# Altium schematic sheet MDB.SchDoc: MDB
size A4; Date: 19 08 2019; Author: Rachid AKKOUCHE; DrawnBy: Rachid AKKOUCHE; Engineer: Rachid AKKOUCHE; DocumentNumber: BRA201909261; Revision: II B; SheetNumber: 3; SheetTotal: 3; Telephone: +33651604047; Email: rachid.akkouche@wanadoo.fr; Proprietaire: Rachid AKKOUCHE; Dessinepar: -; Verifiepar: -; Property: Rachid AKKOUCHE; Time: 08:00
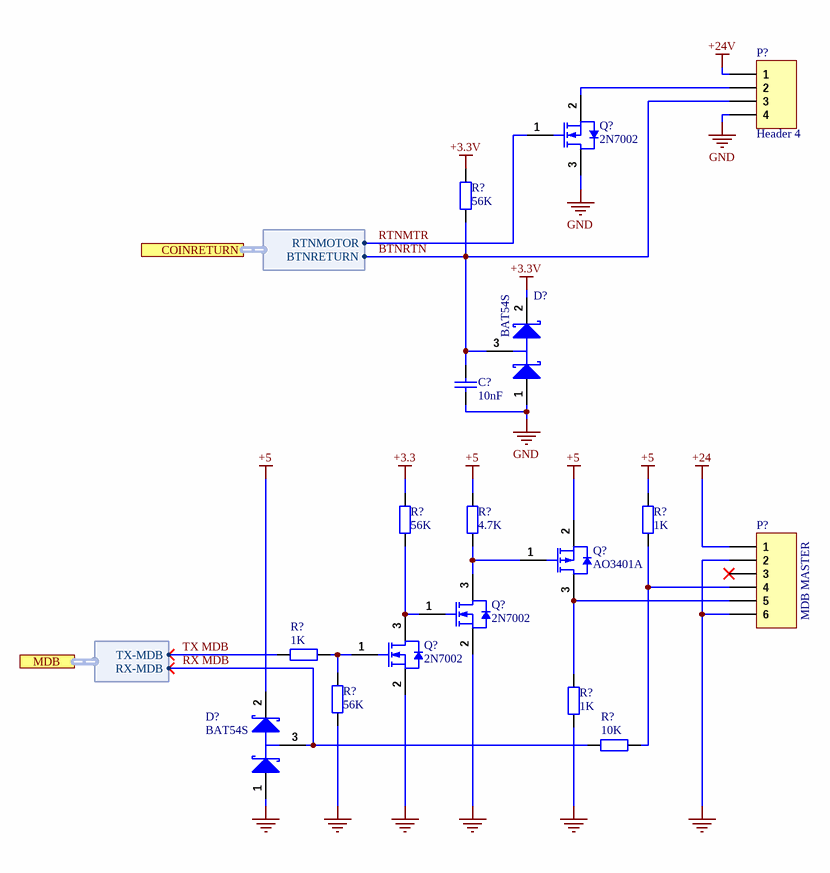
[diagram p0: MDB.SchDoc]

## Parts
(Parts that share a designator on the sheet are numbered #1, #2 ... from top to bottom, then left to right.)
C?  10nF  [C0805]
D?#1  BAT54S  [SOT23]
D?#2  BAT54S  [SOT23]
P?#1  Header 4  [Molex 22112042]
P?#2  MDB MASTER  [MOLEX 39-28-1063]
Q?#1  2N7002  [SOT23]
Q?#2  AO3401A  [SOT23]
Q?#3  2N7002  [SOT23]
Q?#4  2N7002  [SOT23]
R?#1  56K  [R0805]
R?#2  4.7K  [R 0805(2012)]
R?#3  1K  [R 0805(2012)]
R?#4  56K  [R 0805(2012)]
R?#5  1K  [R 0805(2012)]
R?#6  56K  [R 0805(2012)]
R?#7  1K  [R 0805(2012)]
R?#8  10K  [R 0805(2012)]

## Ports
COINRETURN (harness Return), MDB (harness MDB)

## Harnesses
MDB: RX-MDB, TX-MDB
Return: RTNMOTOR, BTNRETURN

## Nets
+3.3: R?#4.1
+3.3V: D?#1.2(K) R?#1.1
+5: D?#2.2(K) Q?#2.2(S) R?#2.2 R?#3.2
+24: P?#2.1
+24V: P?#1.1
GND: C?.2 D?#1.1(A) D?#2.1(A) P?#1.4 P?#2.2 P?#2.6 Q?#1.3(D) Q?#3.2(S) Q?#4.2(S) R?#6.1 R?#7.1
BTNRTN: C?.1 D?#1.3(C) P?#1.3 R?#1.2 ; port COINRETURN.BTNRETURN
RTNMTR: Q?#1.1(G) ; port COINRETURN.RTNMOTOR
RX MDB: D?#2.3(C) R?#8.2 ; port MDB.RX-MDB
TX MDB: R?#5.2 ; port MDB.TX-MDB
NetP?#1_2: P?#1.2 Q?#1.2(S)
NetP?#2_4: P?#2.4 R?#3.1 R?#8.1
NetP?#2_5: P?#2.5 Q?#2.3(D) R?#7.2
NetQ?#2_1: Q?#2.1(G) Q?#3.3(D) R?#2.1
NetQ?#3_1: Q?#3.1(G) Q?#4.3(D) R?#4.2
NetQ?#4_1: Q?#4.1(G) R?#5.1 R?#6.2

Not connected (* = marked no-connect by the designer): P?#2 3*

## Notes on the sheet
- Ce document est la propriété de
- Project:
- Il ne peut être divulgué sans l'accord écrit de l'un de ses représentants dûment mandaté
- Title:
- Number:
- Date:
- Time:
- Size:
- A4
- Revision:
- Sheet
- of
- 2, rue Georges MELIES
- Draw by:
- 78390 BOIS D'ARCY

## Library data of the parts
C? = Cap 0805 100nF: Capacitor; Manufacturer: MULTICOMP; Manufacturer Part Number: MC0805F103Z500CT; Gamme de produit: Série MC; Capacité: 0.01; Tolérance de capacité: +80%, -20%; Diélectrique: Y5; Tension: 50; Boîtier de condensateur Céramique: 0805 [2012 Metric]; Température d'utilisation min: -30; Température de fonctionnement max..: 85; Type de packaging: Bande découpée; SVHC: No SVHC (15-Jun-2015); Bornes de condensateur: CMS; Température de fonctionnement: -30°C à +85; Tolérance de capacité ±: +80%, -20; Supplier 1: Farnell; Supplier Part Number 1: 1759247; RoHS: YES; Stock 1: 94719; Pricing 1: 10=0.0277, 250=0.025, 500=0.0222, 1000=0.0148, 2000=0.0111, 4000=0.0089, 20000=0.0059, 40000=0.0047 (EUR); MSL: -; ComponentLink1URL: http://www.farnell.com/datasheets/1901289.pdf; ComponentLink1Description: http://www.farnell.com/datasheets/1901289.pdf
D?#1 = BAT54S: Schottky Barrier Double Diode; Manufacturer: MULTICOMP; Courant, If moy.: 200; Tension, Vrrm: 30; Tension, Vf max..: 400; Temps trr max.: 5; Courant, Ifs max.: 600; Type de boîtier diode: SOT-23; Nombre de broches: 3; SVHC: No SVHC (19-Dec-2012); Configuration diode: Dual Series; Température, Tj max..: 150; Type de terminaison: SMD; Température d'utilisation min: -55; Courant, If, Vf: 10; Courant, Ir, max..: 2; Marquage, CMS: L44; Température de fonctionnement: -55°C à +150; Type de packaging: Bande découpée; Tension, direct à  If: 800; Supplier 1: Farnell; Supplier Part Number 1: 1621835; Manufacturer Part Number: BAT54S; RoHS: YES; Stock 1: 52055; Pricing 1: 10=0,102, 250=0,074, 1000=0,06, 3000=0,053 (EUR); Diode Type: Schottky; Type de boîtier: SOT-23; courant Ifsm: 600; ComponentLink1URL: http://www.farnell.com/datasheets/1317753.pdf; ComponentLink1Description: http://www.farnell.com/datasheets/1317753.pdf; Température de fonctionnement max..: 150; Supplier 2: Farnell; Supplier Part Number 2: 1467519; Stock 2: 11232; Pricing 2: 5=0,157, 90=0,066, 250=0,056, 750=0,0443, 1500=0,0388 (EUR); Type de boîtier de diode: SOT-23; MSL: MSL 1 - Illimité; Type de diode: Schottky; ComponentLink2URL: http://www.farnell.com/datasheets/1997854.pdf; ComponentLink2Description: http://www.farnell.com/datasheets/1997854.pdf
D?#2 = BAT54S: Schottky Barrier Double Diode; Manufacturer: MULTICOMP; Courant, If moy.: 200; Tension, Vrrm: 30; Tension, Vf max..: 400; Temps trr max.: 5; Courant, Ifs max.: 600; Type de boîtier diode: SOT-23; Nombre de broches: 3; SVHC: No SVHC (19-Dec-2012); Configuration diode: Dual Series; Température, Tj max..: 150; Type de terminaison: SMD; Température d'utilisation min: -55; Courant, If, Vf: 10; Courant, Ir, max..: 2; Marquage, CMS: L44; Température de fonctionnement: -55°C à +150; Supplier 1: Farnell; Supplier Part Number 1: 1621835; Manufacturer Part Number: BAT54S; RoHS: YES; Stock 1: 52055; Pricing 1: 10=0,102, 250=0,074, 1000=0,06, 3000=0,053 (EUR); Diode Type: Schottky; Type de boîtier: SOT-23; courant Ifsm: 600; ComponentLink1URL: http://www.farnell.com/datasheets/1317753.pdf; ComponentLink1Description: http://www.farnell.com/datasheets/1317753.pdf; Température de fonctionnement max..: 150
P?#1 = Header 4: Header, 4-Pin; Manufacturer: TE CONNECTIVITY / AMP; Manufacturer Part Number: 640454-4; Gamme de produit: Série MTA-100; Type de terminaison de contact: Traversant; Genre: Embase; Nombre de contacts: 4; Pas: 2.54; Plaquage du contact: Contacts plaqués étain; Matériau du contact: Alliage de cuivre; Nombre de rangées: 1; Méthode de terminaison: A souder; Tension nominale Vac: 250; Terminaison du contact: Traversant vertical<!--FANDB--><div class="features-and-benefits-container"><div class="features-and-benefits-description"><span class="features-benefits-value">The 640454-4 is a 4-position 1-row unshrouded Polarized Header with pin type tin-plated copper alloy straight posts, UL94V-0-rated glass-filled polyester housing and nickel-plated underplate. This vertical header is suitable for use with MTA-100 connector assembly.</span></div><div class="features-and-benefits-list"><ul class="features-and-benefits-list-list"><li class="features-and-benefits-list-item">250VAC Operating voltage</li><li class="features-and-benefits-list-item">5A Contact current rating</li><li class="features-and-benefits-list-item">UL94V-0 Flammability rating</li></ul></div><div class="features-and-benefits-applications"><ul class="features-and-benefits-value"><li class="features-and-benefits-list-item">Industrie</li></ul></div></div>; A utiliser avec: MTA .100 Headers & MTA .100 IDC Posted Connectors; Supplier 1: Farnell; Supplier Part Number 1: 588490; RoHS: YES; Stock 1: 22887; Pricing 1: 5=0.173, 50=0.0985, 500=0.0828, 1000=0.0599 (EUR); Courant: 4; Tension, fonctionnement: 250; ComponentLink1URL: http://www.farnell.com/datasheets/1667877.pdf; ComponentLink1Description: http://www.farnell.com/datasheets/1667877.pdf; ComponentLink2URL: http://www.farnell.com/cad/1650873.pdf; ComponentLink2Description: http://www.farnell.com/cad/1650873.pdf; ComponentLink3URL: http://www.farnell.com/datasheets/2007156.pdf; ComponentLink3Description: http://www.farnell.com/datasheets/2007156.pdf; Supplier 2: Farnell; Supplier Part Number 2: 2468503; Stock 2: 2449; Pricing 2: 10=0.31, 100=0.279, 500=0.251, 1000=0.226, 5000=0.203, 10000=0.183 (EUR); Nombre de Positions: 4; ComponentLink4URL: http://www.farnell.com/cad/1651660.pdf; ComponentLink4Description: http://www.farnell.com/cad/1651660.pdf
P?#2 = MOLEX 039281063: 6 Pin Vertical Header MINI FIT JR MOLEX PN 39281063 WITHOUT PEGS * Disc by Waytek; Max Voltage Rating (DC): 600.6kV; Current Rating: 9A; Voltage Rating: 600V; Max Current Rating: 3A; Number of Poles: 6; Voltage Rating (AC): 250V; Connector Type: Power,Rectangular; Gender: Male; Insulation Resistance: 1GR; Pitch: 4.2mm; Approvals: UL,CSA,TUV; Glow Wire Compliant: Non-compliant; Supplier 1: Farnell; Manufacturer 1: Molex; Manufacturer Part Number 1: 39-28-1063; RoHS: Yes; Category: Headers and Wire Housings; Stock 1: 11240; Mount: Through Hole; Contact Plating: Tin,Gold; Contact Material: Brass,Bronze; Color: Natural,Clear; Material: Nylon; Housing Color: Black; Housing Material: Nylon; Min Operating Temperature: -40°C; Max Operating Temperature: 105°C; Number of Rows: 2; Contact Gender: Male; Packaging: Bulk; Number of Positions: 6; Termination: Solder; Number of Contacts: 6; Working Voltage: 250V; Orientation: Straight; Voltage Rating (DC): 600V; Number of Circuits: 6; Length: 101.19mm; Height: 6.04mm; Lead Pitch: 4.2mm; Row Spacing: 4.2mm; Depth: 14.18mm; Radiation Hardening: No; REACH SVHC: Unknown; Halogen Free: Low Halogen; Lead Free: Lead Free; Flammability Rating: UL94 V-2; ComponentLink1URL: https://datasheet.ciiva.com/19462/1968769-19462120.pdf?src-supplier=Jameco; ComponentLink1Description: https://datasheet.ciiva.com/19462/1968769-19462120.pdf?src-supplier=Jameco; ComponentLink2URL: https://datasheet.ciiva.com/11748/0900766b80460da2-11748025.pdf?src-supplier=RSComponents; ComponentLink2Description: https://datasheet.ciiva.com/11748/0900766b80460da2-11748025.pdf?src-supplier=RSComponents; ComponentLink3URL: https://datasheet.ciiva.com/25908/0039281063-pcb-headers-25908512.pdf?src-supplier=Avnet+Europe; ComponentLink3Description: https://datasheet.ciiva.com/25908/0039281063-pcb-headers-25908512.pdf?src-supplier=Avnet+Europe; ComponentLink4URL: https://datasheet.ciiva.com/5152/0039281063-pcb-headers-228415-5152246.pdf?src-supplier=Mouser; ComponentLink4Description: https://datasheet.ciiva.com/5152/0039281063-pcb-headers-228415-5152246.pdf?src-supplier=Mouser; ComponentLink5URL: https://datasheet.ciiva.com/26916/getdatasheetpartid-292509-26916569.pdf?src-supplier=Verical; ComponentLink5Description: https://datasheet.ciiva.com/26916/getdatasheetpartid-292509-26916569.pdf?src-supplier=Verical; ComponentLink6URL: https://datasheet.ciiva.com/16468/0039281063-pcb-headers-16468972.pdf?src-supplier=Avnet+Asia; ComponentLink6Description: https://datasheet.ciiva.com/16468/0039281063-pcb-headers-16468972.pdf?src-supplier=Avnet+Asia; ComponentLink7URL: https://datasheet.ciiva.com/20209/22-3810e-20209534.pdf?src-supplier=Rapid+Electronics; ComponentLink7Description: https://datasheet.ciiva.com/20209/22-3810e-20209534.pdf?src-supplier=Rapid+Electronics; Supplier Part Number 1: 9732101
Q?#1 = 2N7002: N-channel Enhancement Mode Field-effect Transistor; Manufacturer: FAIRCHILD SEMICONDUCTOR; Supplier 1: Farnell; Supplier Part Number 1: 9512608; Manufacturer Part Number: 2N7002; RoHS: YES; Pricing 1: 5=0,138, 25=0,13, 100=0,059, 1000=0,049, 3000=0,026, 6000=0,0234 (EUR); ComponentLink1URL: http://www.farnell.com/datasheets/660093.pdf; ComponentLink1Description: http://www.farnell.com/datasheets/660093.pdf; ComponentLink2URL: http://www.farnell.com/datasheets/410597.pdf; ComponentLink2Description: http://www.farnell.com/datasheets/410597.pdf
Q?#2 = AO3401A: MOSFET P-CH 30V 4A SOT23; Manufacturer: Alpha & Omega Semiconductor; Rds On Max: 44mR; Input Capacitance: 1.2nF; Max Power Dissipation: 1.4W; Number of Elements: 1; Supplier 1: Arrow Electronics; Manufacturer Part Number: AO3401A; RoHS: Yes; Category: MOSFETs; Pricing 1: 6000=0,07860, 15000=0,06960, 30000=0,06870, 75000=0,05840, 150000=0,05610, 6000=0,08240, 60000=0,07800, 600000=0,05360, 3000000=0,04250, 6000000=0,04240 (USD); Mount: Surface Mount; Case/Package: TO-236-3; Number of Pins: 3; Min Operating Temperature: -55°C; Max Operating Temperature: 150°C; Packaging: Tape and Reel; Drain to Source Voltage (Vdss): 30V; Continuous Drain Current (ID): 4A; Power Dissipation: 1.4W; Series: -; Radiation Hardening: No; Lead Free: Lead Free; RoHS Compliant: Yes; ComponentLink1URL: https://datasheet.ciiva.com/940/ao3401a-940720.pdf?src-supplier=Digi-Key; ComponentLink1Description: https://datasheet.ciiva.com/940/ao3401a-940720.pdf?src-supplier=Digi-Key; ComponentLink2URL: https://datasheet.ciiva.com/26927/getdatasheetpartid-79048-26927888.pdf?src-supplier=Verical; ComponentLink2Description: https://datasheet.ciiva.com/26927/getdatasheetpartid-79048-26927888.pdf?src-supplier=Verical; Supplier Part Number 1: AO3401A
Q?#3 Q?#4 = 2N7002: N-channel Enhancement Mode Field-effect Transistor; Continuous Drain Current (ID): 115mA; Drain to Source Breakdown Voltage: 60V; Drain to Source Resistance: 7.5R; Element Configuration: Single; Gate to Source Voltage (Vgs): 20V; Input Capacitance: 50pF; Max Power Dissipation: 225mW; Nominal Vgs: 2.5V; Number of Channels: 1; Power Dissipation: 300mW; Turn-Off Delay Time: 40ns; Turn-On Delay Time: 20ns; ComponentLink1URL: http://www.farnell.com/datasheets/660093.pdf; ComponentLink1Description: http://www.farnell.com/datasheets/660093.pdf; ComponentLink2URL: http://www.farnell.com/datasheets/410597.pdf; ComponentLink2Description: http://www.farnell.com/datasheets/410597.pdf; Case/Package: SOT-23-3; Contact Plating: Tin; Current Rating: 115mA; Drain to Source Voltage (Vdss): 60V; Halogen Free: Halogen Free; Height: 1.01mm; Lead Free: Lead Free; Length: 3.04mm; Max Operating Temperature: 150°C; Min Operating Temperature: -55°C; Number of Elements: 1; Number of Pins: 3; On-State Resistance: 7.5R; Package Quantity: 1; Packaging: Tape and Reel; Radiation Hardening: No; Rds On Max: 7.5R; REACH SVHC: No SVHC; Threshold Voltage: 2.5V; Voltage Rating (DC): 60V; Width: 1.4mm; Supplier 1: TME; Supplier Part Number 1: 2N7002LT1G
R?#1 = Resistor 0805 56K: Resistor; Manufacturer: MULTICOMP; Manufacturer Part Number: MC01W0805556K; Supplier 1: Farnell; Supplier Part Number 1: 9334700; RoHS: Y-EX; Stock 1: 1329; Pricing 1: 10=0.0156, 250=0.0133, 500=0.0111, 1250=0.0088, 2500=0.0053, 5000=0.0038, 25000=0.0022, 50000=0.0019 (EUR); ComponentLink1URL: http://www.farnell.com/datasheets/1716700.pdf; ComponentLink1Description: http://www.farnell.com/datasheets/1716700.pdf
R?#2 = Resistor 0805 4.7K: Resistor SMD 0805 4.7K; Manufacturer: MULTICOMP; Manufacturer Part Number: MC01W080514K7; Product Range: MULTICOMP - MC Series; Résistance: 4.7; Puissance: 100; Tolérance de résistance: ± 1%; Type de boîtier de résistance: 0805; Type de résistance: Couche épaisse; Coefficient de température: ± 100; Tension: 150; Type de packaging: Full Reel; SVHC: No SVHC (20-Jun-2013); Resistor Mounting: CMS; Supplier 1: Farnell; RoHS: YES; Pricing 1: 5000=0,001 (EUR); MSL: (Non Applicable); ComponentLink1URL: http://www.farnell.com/datasheets/1729047.pdf; ComponentLink1Description: http://www.farnell.com/datasheets/1729047.pdf; Supplier Part Number 1: 2129167
R?#3 R?#5 R?#7 = Resistor 0805 1K: Resistor SMD 0805 1K; Manufacturer: MULTICOMP; Manufacturer Part Number: MC0.1W08051%1KFR; Product Range: MULTICOMP - MC Series; Résistance: 1; Puissance: 100; Tolérance de résistance: ± 1%; Type de boîtier de résistance: 0805; Type de résistance: Couche épaisse; Coefficient de température: ± 100; Tension: 150; Type de packaging: Full Reel; Resistor Mounting: CMS; Supplier 1: Farnell; RoHS: YES; Pricing 1: 5000=0,001 (EUR); MSL: MSL 1 - Illimité; ComponentLink1URL: http://www.farnell.com/datasheets/1716700.pdf; ComponentLink1Description: http://www.farnell.com/datasheets/1716700.pdf; Supplier Part Number 1: 2129113
R?#4 R?#6 = Resistor 0805 56K: Resistor SMD 0805 56K; Manufacturer: MULTICOMP; Manufacturer Part Number: MC0.1W08051%56KFR; Product Range: MULTICOMP - MC Series; Résistance: 56; Puissance: 100; Tolérance de résistance: ± 1%; Type de boîtier de résistance: 0805; Type de résistance: Couche épaisse; Coefficient de température: ± 100; Tension: 150; Type de packaging: Full Reel; Resistor Mounting: CMS; Resistor Terminals: (Non Disponible); Supplier 1: Farnell; Supplier Part Number 1: 2129258; RoHS: YES; Pricing 1: 5000=0,001 (EUR); ComponentLink1URL: http://www.farnell.com/datasheets/1716700.pdf; ComponentLink1Description: http://www.farnell.com/datasheets/1716700.pdf; MSL: (Non Applicable)
R?#8 = Resistor 0805 10K: Resistor SMD 0805 10K; Manufacturer: MULTICOMP; Manufacturer Part Number: MC0.1W08051%10KFR; Résistance: 10; Puissance: 100; Tolérance de résistance: ± 1%; Tension: 150; Type de boîtier de résistance: 0805; Type de packaging: Full Reel; Type de résistance: Couche épaisse; Coefficient de température: ± 100; Product Range: MULTICOMP - MC Series; Resistor Mounting: CMS; Supplier 1: Farnell; Supplier Part Number 1: 2129195; RoHS: YES; Pricing 1: 5000=0,001 (EUR); MSL: MSL 1 - Illimité; ComponentLink1URL: http://www.farnell.com/datasheets/1716700.pdf; ComponentLink1Description: http://www.farnell.com/datasheets/1716700.pdf